# EAGLE schematic sasquatch_v2 (EAGLE 6.5.0)
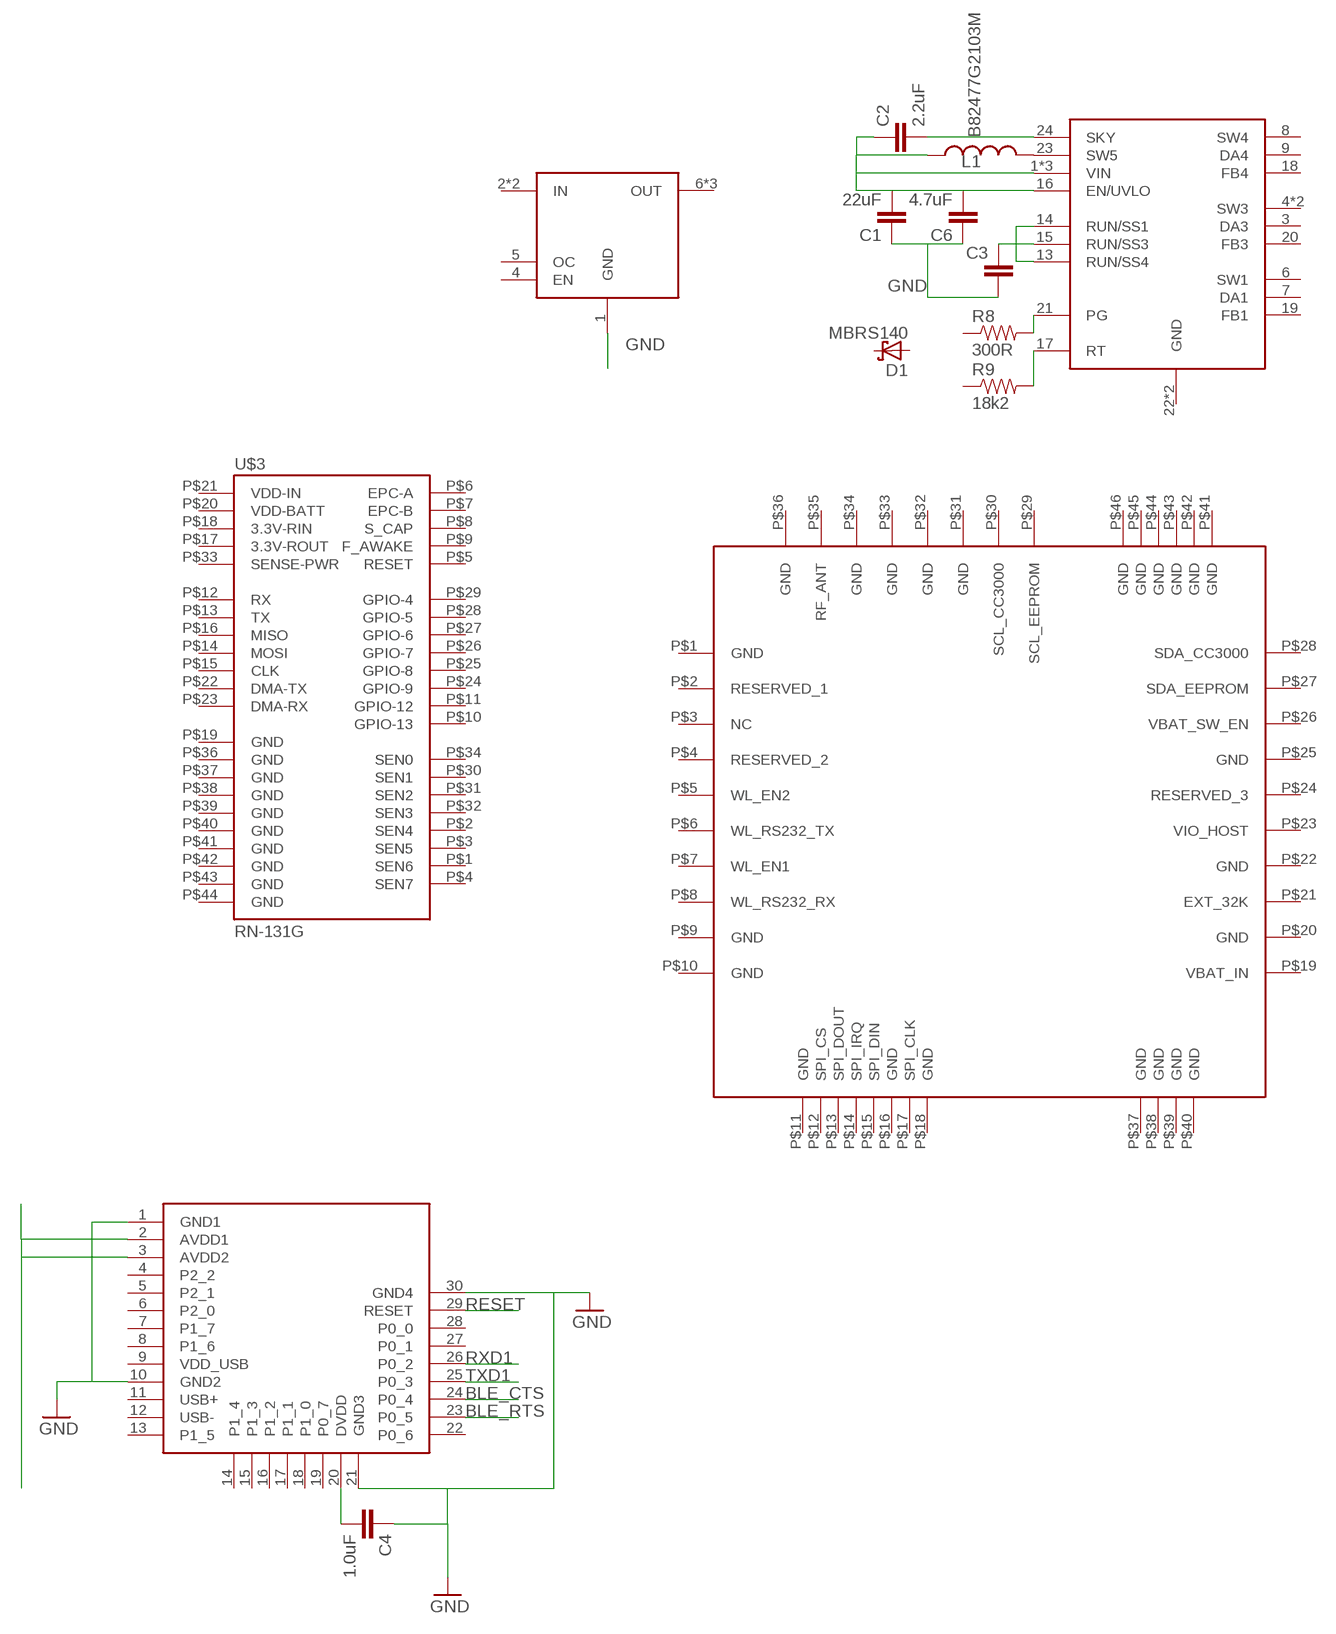
[diagram p0: schematic, sheet 1]

## Parts
C1  22uF  22UF-16V-20%-(1210)  [1210]
C2  2.2uF  2.2UF-10V-20%(0603)  [0603-CAP]
C3  CAP0402-CAP  [0402-CAP]
C4  1.0uF  1.0UF-16V-10%(0603)  [0603-CAP]
C6  4.7uF  4.7UF-6.3V-10%(0603)0603  [0603-CAP]
D1  MBRS140  SCHOTTKY-DIODESMD  [SMB]
L1  B82477G2103M  [B82477G2]
R8  300R  RESISTOR0603  [0603-RES]
R9  18k2  RESISTOR0603  [0603-RES]
U1  BLE112-A  [BLE112-A]
U$1  MAX1607  [SOIC8]
U$2  LT3514  [TSSOP24AA(FE)]
U$3  RN-131G  [RN-131G]
U$4  CC3000  [CC3000]

## Nets
GND: C1.1 C3.1 C4.1 C6.1 U1.1(GND1) U1.10(GND2) U1.21(GND3) U1.30(GND4) U$1.1(GND)
N$1: C1.2 C2.1 C6.2 L1.1 U$2.1(VIN) U$2.11(VIN) U$2.12(VIN) U$2.16(EN/UVLO)
N$2: L1.2 U$2.23(SW5)
N$3: R9.2 U$2.17(RT)
N$4: C2.2 U$2.24(SKY)
N$5: C3.2 U$2.13(RUN/SS4) U$2.14(RUN/SS1) U$2.15(RUN/SS3)
N$6: R8.2 U$2.21(PG)
N$7: U1.2(AVDD1)
N$8: U1.3(AVDD2)
N$9: C4.2 U1.20(DVDD)
RESET: U1.29(RESET)
RXD1: U1.26(P0_2)
Unconnected: D1.A D1.C R8.1 R9.1 U1.4(P2_2) U1.5(P2_1) U1.6(P2_0) U1.7(P1_7) U1.8(P1_6) U1.9(VDD_USB) U1.11(USB+) U1.12(USB-) U1.13(P1_5) U1.14(P1_4) U1.15(P1_3) U1.16(P1_2) U1.17(P1_1) U1.18(P1_0) U1.19(P0_7) U1.22(P0_6) U1.23(P0_5) U1.24(P0_4) U1.25(P0_3) U1.27(P0_1) U1.28(P0_0) U$1.2(IN) U$1.3(IN) U$1.4(EN) U$1.5(OC) U$1.6(OUT) U$1.7(OUT) U$1.8(OUT) U$2.3(DA3) U$2.4(SW3) U$2.5(SW3) U$2.6(SW1) U$2.7(DA1) U$2.8(SW4) U$2.9(DA4) U$2.18(FB4) U$2.19(FB1) U$2.20(FB3) U$2.22(GND) U$2.25(GND) U$3.P$1(SEN6) U$3.P$2(SEN4) U$3.P$3(SEN5) U$3.P$4(SEN7) U$3.P$5(RESET) U$3.P$6(EPC-A) U$3.P$7(EPC-B) U$3.P$8(S_CAP) U$3.P$9(F_AWAKE) U$3.P$10(GPIO-13) U$3.P$11(GPIO-12) U$3.P$12(RX) U$3.P$13(TX) U$3.P$14(MOSI) U$3.P$15(CLK) U$3.P$16(MISO) U$3.P$17(3.3V-ROUT) U$3.P$18(3.3V-RIN) U$3.P$19(GND) U$3.P$20(VDD-BATT) U$3.P$21(VDD-IN) U$3.P$22(DMA-TX) U$3.P$23(DMA-RX) U$3.P$24(GPIO-9) U$3.P$25(GPIO-8) U$3.P$26(GPIO-7) U$3.P$27(GPIO-6) U$3.P$28(GPIO-5) U$3.P$29(GPIO-4) U$3.P$30(SEN1) U$3.P$31(SEN2) U$3.P$32(SEN3) U$3.P$33(SENSE-PWR) U$3.P$34(SEN0) U$3.P$36(GND) U$3.P$37(GND) U$3.P$38(GND) U$3.P$39(GND) U$3.P$40(GND) U$3.P$41(GND) U$3.P$42(GND) U$3.P$43(GND) U$3.P$44(GND) U$4.P$2(RESERVED_1) U$4.P$3(NC) U$4.P$4(RESERVED_2) U$4.P$5(WL_EN2) U$4.P$6(WL_RS232_TX) U$4.P$7(WL_EN1) U$4.P$8(WL_RS232_RX) U$4.P$9(GND) U$4.P$12(SPI_CS) U$4.P$13(SPI_DOUT) U$4.P$14(SPI_IRQ) U$4.P$15(SPI_DIN) U$4.P$17(SPI_CLK) U$4.P$19(VBAT_IN) U$4.P$20(GND) U$4.P$21(EXT_32K) U$4.P$22(GND) U$4.P$23(VIO_HOST) U$4.P$24(RESERVED_3) U$4.P$25(GND) U$4.P$26(VBAT_SW_EN) U$4.P$27(SDA_EEPROM) U$4.P$28(SDA_CC3000) U$4.P$35(RF_ANT) U$4.P$36(GND) U$4.P$38(GND)

## Power pins joined to a net without a drawn wire
GND: U$4.P$1(GND) U$4.P$10(GND) U$4.P$11(GND) U$4.P$16(GND) U$4.P$18(GND) U$4.P$31(GND) U$4.P$32(GND) U$4.P$33(GND) U$4.P$34(GND) U$4.P$37(GND) U$4.P$39(GND) U$4.P$40(GND) U$4.P$41(GND) U$4.P$42(GND) U$4.P$43(GND) U$4.P$44(GND) U$4.P$45(GND) U$4.P$46(GND)
SCL_CC3000: U$4.P$30(SCL_CC3000)
SCL_EEPROM: U$4.P$29(SCL_EEPROM)

## Library data of the parts
C1 = SparkFun-Capacitors:22UF-16V-20%-(1210): CAP-10381; PROD_ID: CAP-10381
C2 = SparkFun-Capacitors:2.2UF-10V-20%(0603): CAP-07888; PROD_ID: CAP-07888
C3 = SparkFun-Capacitors:CAP: Capacitor Standard 0603 ceramic capacitor, and 0.1" leaded capacitor.
C4 = SparkFun-Capacitors:1.0UF-16V-10%(0603): CAP-00868; PROD_ID: CAP-00868
C6 = SparkFun-Capacitors:4.7UF-6.3V-10%(0603): CAP-08280; PROD_ID: CAP-08280
D1 = diode:SCHOTTKY-DIODE: Schottky Diode
L1 = senior_design_library:B82477G2103M
R8 R9 = SparkFun-Resistors:RESISTOR: Resistor Basic schematic elements and footprints for 0603, 1206, and PTH resistors.
U1 = SparkFun-RF:BLE112-A: BlueGiga Bluetooth 4.0 module with integrated chip antenna and onboard 8051 processor and peripherals
U$1 = senior_design_library:MAX1607
U$2 = senior_design_library:LT3514
U$3 = SparkFun-RF:RN-131G: Roving Netowrks WiFLy GSX Module
U$4 = centerblack_engineering:CC3000: TI SimpleLink CC3000 Module - WiFi 802.11b/g Network Processor; AUTHOR: Matt Bigarani; DATASHEET: http://www.ti.com/lit/ds/symlink/cc3000.pdf; DATE: 2/8/2013